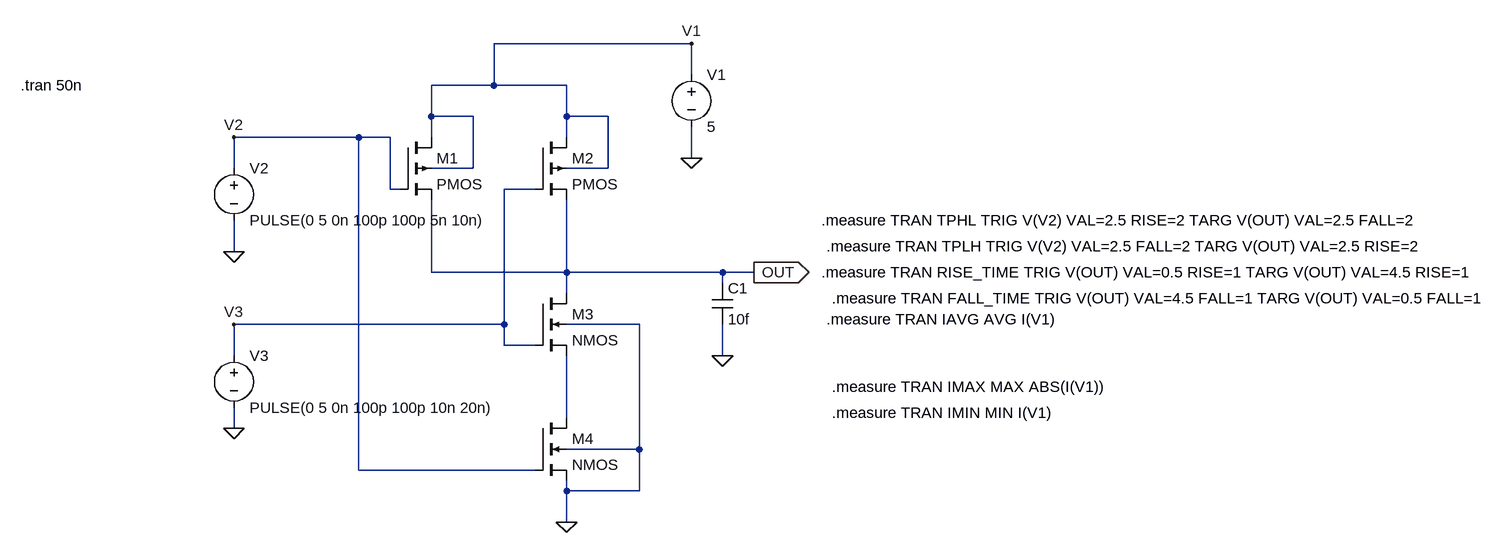
[diagram p0: schematic cmos_nand.asc]
cmos_nand.asc, the LTspice schematic file:
Version 4.1
SHEET 1 2112 680
WIRE 624 -288 320 -288
WIRE 624 -240 624 -288
WIRE 320 -224 320 -288
WIRE 320 -224 224 -224
WIRE 432 -224 320 -224
WIRE 224 -176 224 -224
WIRE 288 -176 224 -176
WIRE 432 -176 432 -224
WIRE 496 -176 432 -176
WIRE 112 -144 -80 -144
WIRE 160 -144 112 -144
WIRE 224 -144 224 -176
WIRE 432 -144 432 -176
WIRE 624 -112 624 -160
WIRE -80 -96 -80 -144
WIRE 288 -96 288 -176
WIRE 288 -96 224 -96
WIRE 496 -96 496 -176
WIRE 496 -96 432 -96
WIRE 160 -64 160 -144
WIRE 176 -64 160 -64
WIRE 384 -64 336 -64
WIRE -80 32 -80 -16
WIRE 224 64 224 -48
WIRE 432 64 432 -48
WIRE 432 64 224 64
WIRE 672 64 432 64
WIRE 720 64 672 64
WIRE 672 80 672 64
WIRE 432 96 432 64
WIRE 336 144 336 -64
WIRE 336 144 -80 144
WIRE 544 144 432 144
WIRE 336 176 336 144
WIRE 384 176 336 176
WIRE -80 192 -80 144
WIRE 672 192 672 144
WIRE 432 288 432 192
WIRE -80 304 -80 272
WIRE 544 336 544 144
WIRE 544 336 432 336
WIRE 112 368 112 -144
WIRE 384 368 112 368
WIRE 432 400 432 384
WIRE 544 400 544 336
WIRE 544 400 432 400
WIRE 432 448 432 400
FLAG 432 448 0
FLAG 624 -112 0
FLAG -80 32 0
FLAG -80 304 0
FLAG 720 64 OUT
IOPIN 720 64 Out
FLAG 672 192 0
FLAG -80 -144 V2
FLAG -80 144 V3
FLAG 624 -288 V1
SYMBOL pmos4 176 -144 R0
SYMATTR InstName M1
SYMBOL pmos4 384 -144 R0
SYMATTR InstName M2
SYMBOL nmos4 384 96 R0
SYMATTR InstName M3
SYMBOL nmos4 384 288 R0
SYMATTR InstName M4
SYMBOL voltage 624 -256 R0
SYMATTR InstName V1
SYMATTR Value 5
SYMBOL voltage -80 -112 R0
WINDOW 123 0 0 Left 0
WINDOW 39 0 0 Left 0
SYMATTR InstName V2
SYMATTR Value PULSE(0 5 0n 100p 100p 5n 10n)
SYMBOL voltage -80 176 R0
WINDOW 123 0 0 Left 0
WINDOW 39 0 0 Left 0
SYMATTR InstName V3
SYMATTR Value PULSE(0 5 0n 100p 100p 10n 20n)
SYMBOL cap 656 80 R0
SYMATTR InstName C1
SYMATTR Value 10f
TEXT -408 -224 Left 2 !.tran 50n
TEXT 824 -16 Left 2 !.measure TRAN TPHL TRIG V(V2) VAL=2.5 RISE=2 TARG V(OUT) VAL=2.5 FALL=2
TEXT 832 24 Left 2 !.measure TRAN TPLH TRIG V(V2) VAL=2.5 FALL=2 TARG V(OUT) VAL=2.5 RISE=2
TEXT 824 64 Left 2 !.measure TRAN RISE_TIME TRIG V(OUT) VAL=0.5 RISE=1 TARG V(OUT) VAL=4.5 RISE=1
TEXT 840 104 Left 2 !.measure TRAN FALL_TIME TRIG V(OUT) VAL=4.5 FALL=1 TARG V(OUT) VAL=0.5 FALL=1
TEXT 832 136 Left 2 !.measure TRAN IAVG AVG I(V1)
TEXT 840 240 Left 2 !.measure TRAN IMAX MAX ABS(I(V1))
TEXT 840 280 Left 2 !.measure TRAN IMIN MIN I(V1)

The netlist it stands for:
* cmos_nand.asc
M1 V1 V2 OUT V1 PMOS
M2 V1 V3 OUT V1 PMOS
M3 OUT V3 N001 0 NMOS
M4 N001 V2 0 0 NMOS
V1 V1 0 5
V2 V2 0 PULSE(0 5 0n 100p 100p 5n 10n)
V3 V3 0 PULSE(0 5 0n 100p 100p 10n 20n)
C1 OUT 0 10f
.model NMOS NMOS
.model PMOS PMOS
.lib standard.mos
.tran 50n
.measure TRAN TPHL TRIG V(V2) VAL=2.5 RISE=2 TARG V(OUT) VAL=2.5 FALL=2
.measure TRAN TPLH TRIG V(V2) VAL=2.5 FALL=2 TARG V(OUT) VAL=2.5 RISE=2
.measure TRAN RISE_TIME TRIG V(OUT) VAL=0.5 RISE=1 TARG V(OUT) VAL=4.5 RISE=1
.measure TRAN FALL_TIME TRIG V(OUT) VAL=4.5 FALL=1 TARG V(OUT) VAL=0.5 FALL=1
.measure TRAN IAVG AVG I(V1)
.measure TRAN IMAX MAX ABS(I(V1))
.measure TRAN IMIN MIN I(V1)
.backanno
.end

* Results of the author's LTspice run, read from the files saved beside the schematic
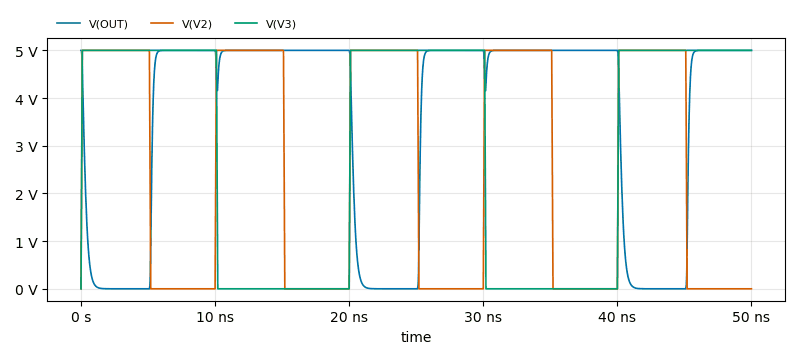
[diagram p1: Transient Analysis of cmos_nand.asc, plotted from the saved traces]
* Transient Analysis, 1 run:
*   V(OUT): min 0 V, max 5 V, average 3.505 V, rms 4.149 V, last 5 V
*   V(V2): min 0 V, max 5 V, average 2.55 V, rms 3.561 V, last 0 V
*   V(V3): min 0 V, max 5 V, average 3.015 V, rms 3.878 V, last 5 V